# Altium schematic sheet Sinus_Inverter.SchDoc
size 1200 x 800 mm; SheetNumber: 1; SheetTotal: 1
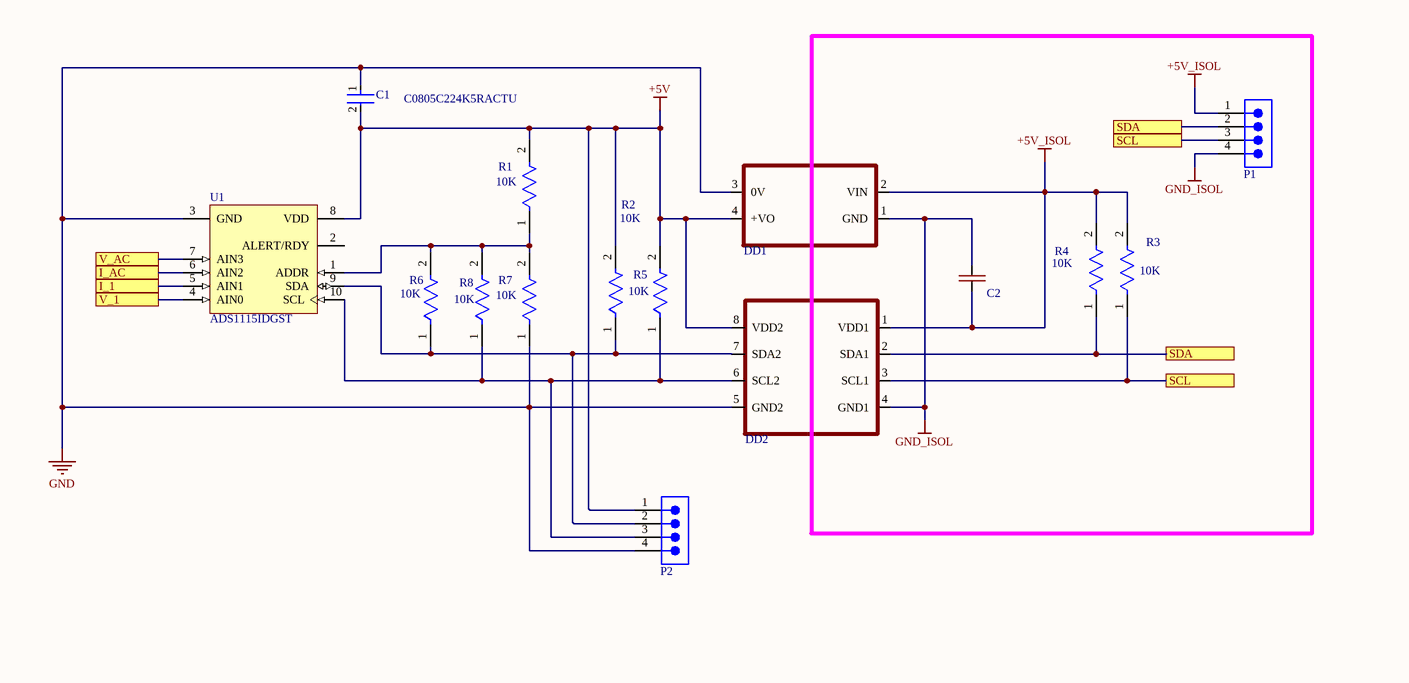
[diagram p0: Sinus_Inverter.SchDoc, top left]
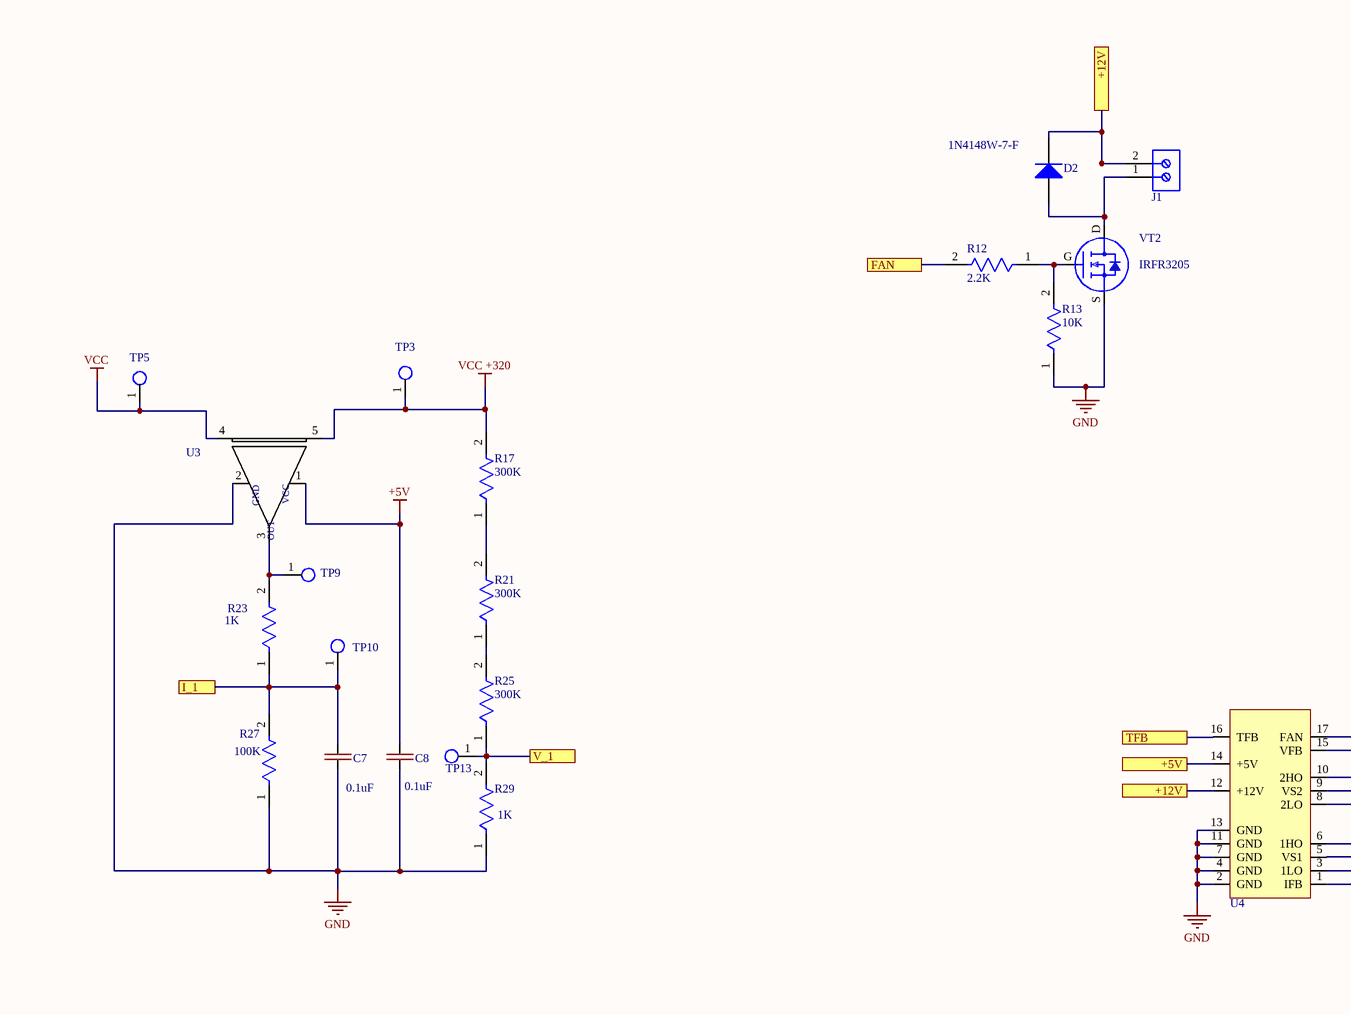
[diagram p1: Sinus_Inverter.SchDoc, top middle]
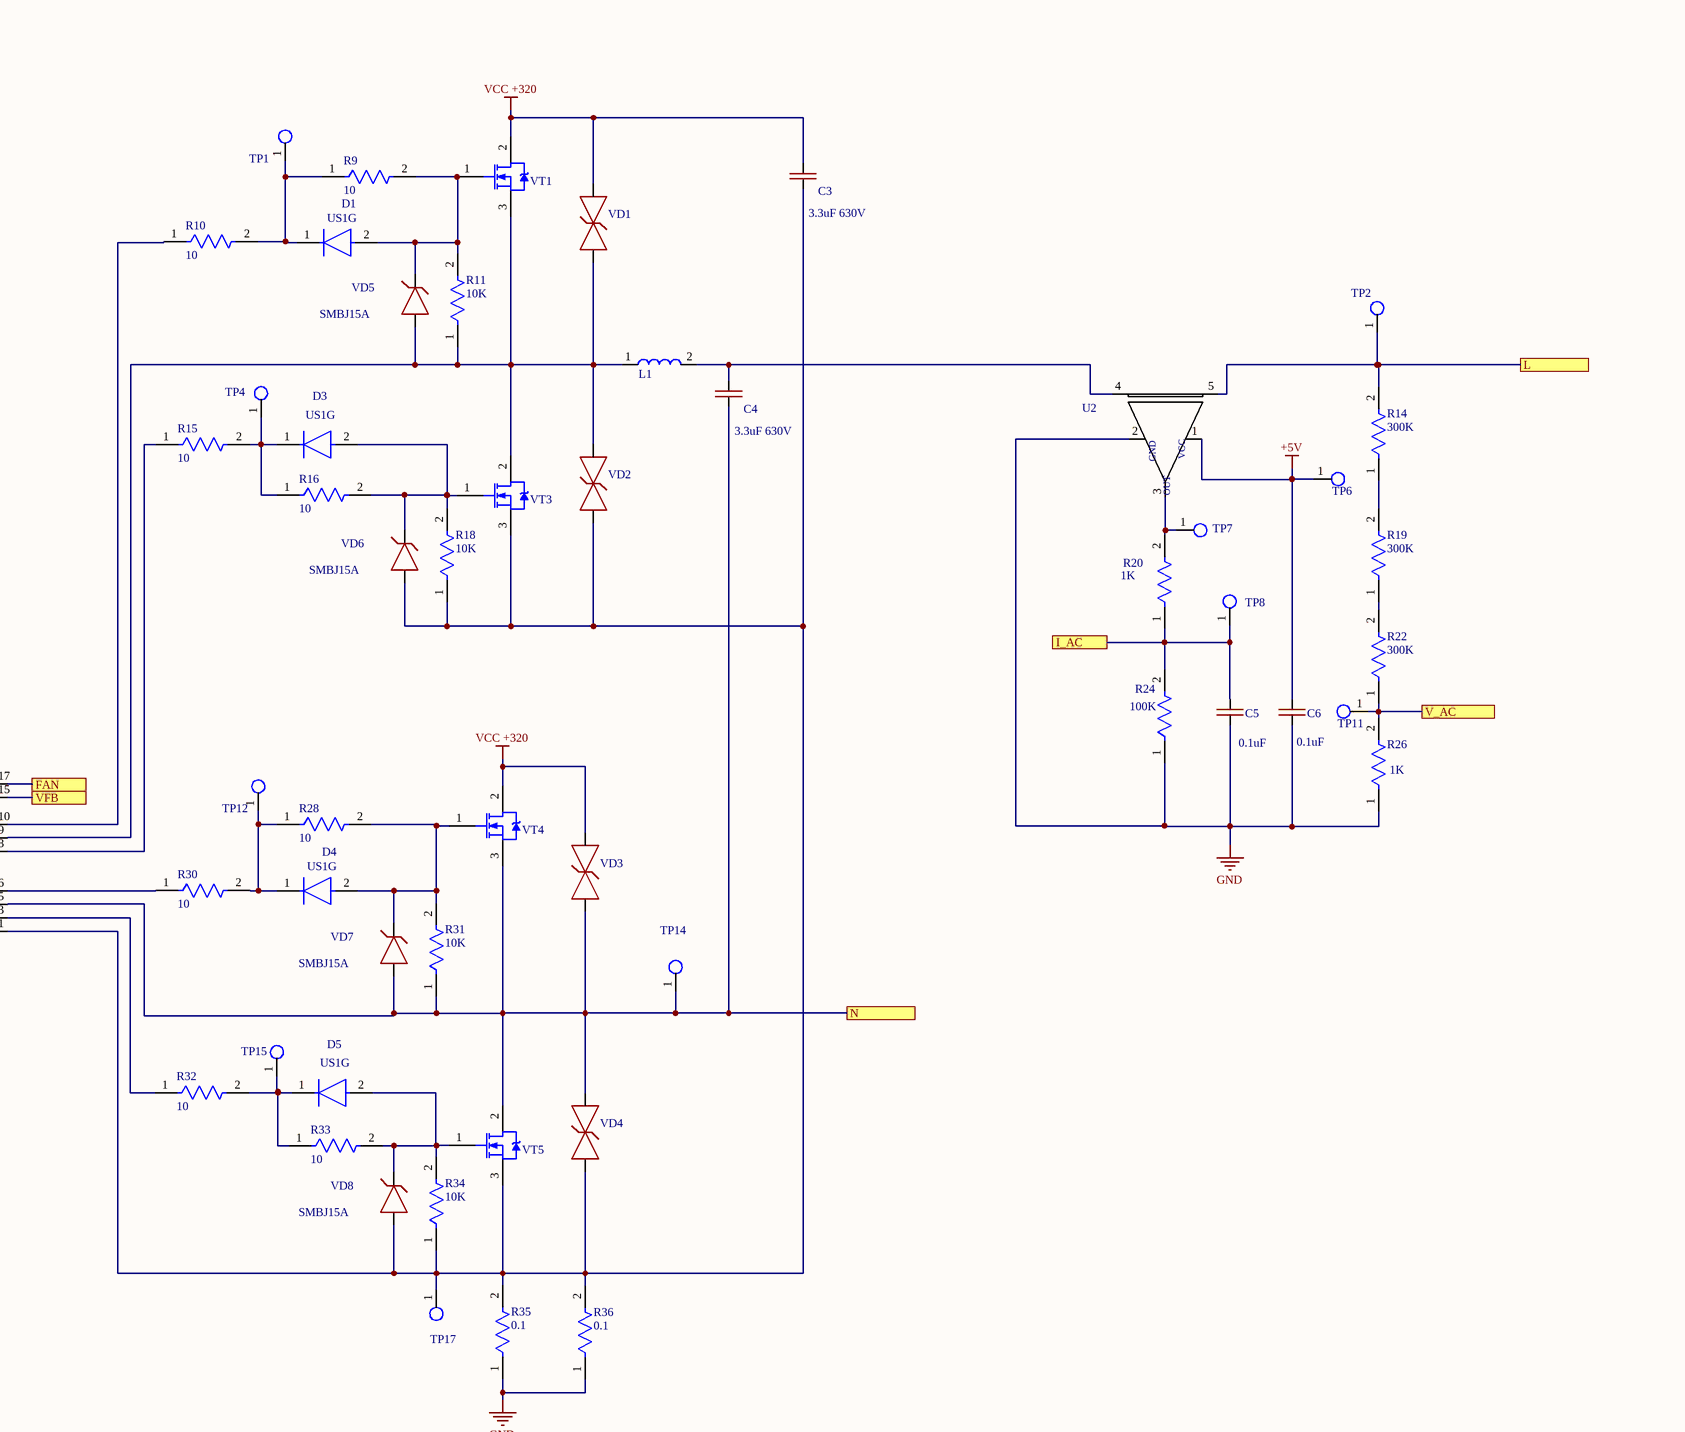
[diagram p2: Sinus_Inverter.SchDoc, top right]
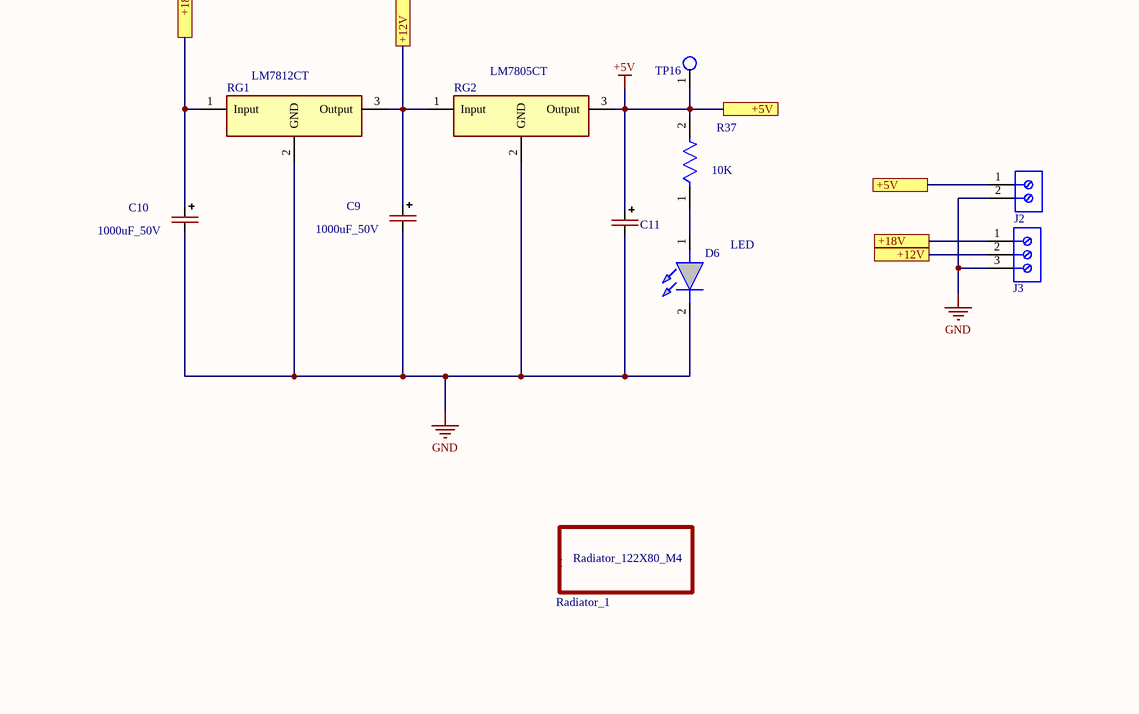
[diagram p3: Sinus_Inverter.SchDoc, bottom middle]
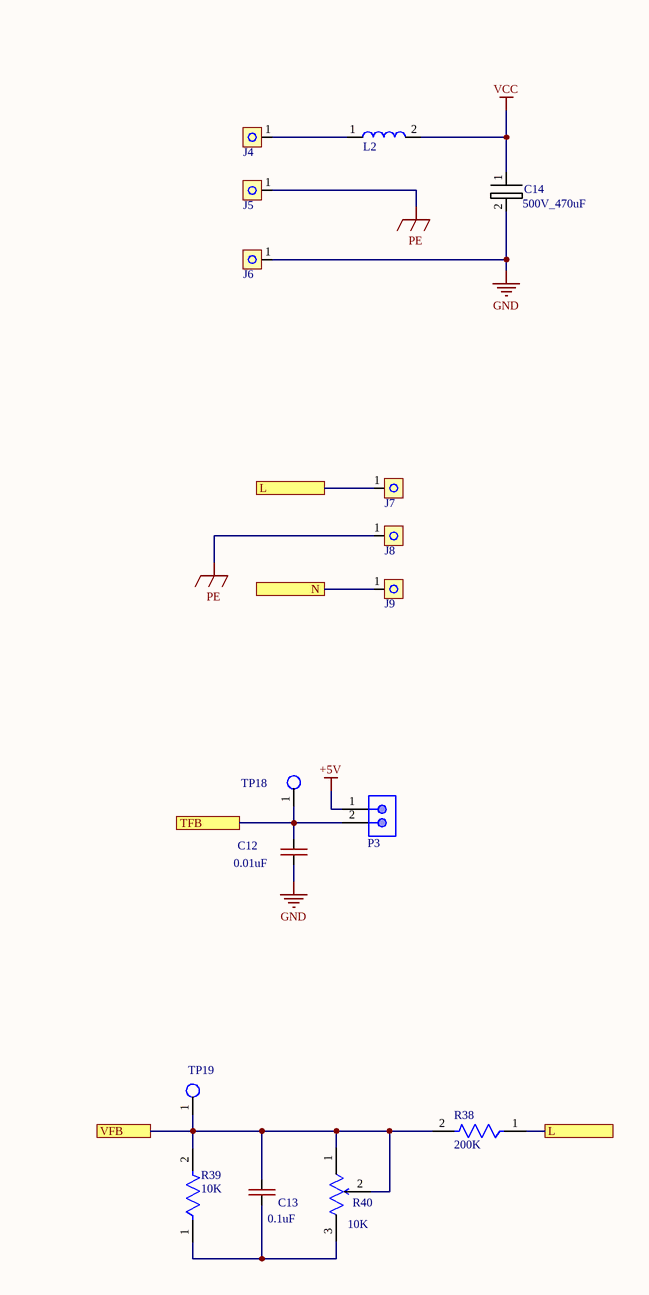
[diagram p4: Sinus_Inverter.SchDoc, bottom right]

## Parts
C1  C0805C224K5RACTU  [FP-C0805C-DN-MFG]
C2  CAP-NON-POLAR  [CAP-0805]  (value not drawn)
C3  3.3uF 630V  [CAP_4.7uF_630V]
C4  3.3uF 630V  [CAP_4.7uF_630V]
C5  0.1uF  [CAP-0805]
C6  0.1uF  [CAP-0805]
C7  0.1uF  [CAP-0805]
C8  0.1uF  [CAP-0805]
C9  1000uF_50V  [CAP_POL_13x26_1000uF_50V]
C10  1000uF_50V  [CAP_POL_13x26_1000uF_50V]
C11  CAP-POLAR  [CAPPOL-16x25]  (value not drawn)
C12  0.01uF  [CAP-0805]
C13  0.1uF  [CAP-0805]
C14  500V_470uF  [500V_470uF]
D1  US1G  [US1G_SMA]
D2  1N4148W-7-F  [DIOD-SOD123-2_V]
D3  US1G  [US1G_SMA]
D4  US1G  [US1G_SMA]
D5  US1G  [US1G_SMA]
D6  LED  [LED_BLUE]
DD1  B0505S-1W  [PLS-4-2.54mm]  (value not drawn)
DD2  ADUM1250ARZ  [SO8-150]  (value not drawn)
J1  691102710002  [691102710002]  (value not drawn)
J2  691101710002  [691101710002]  (value not drawn)
J3  691101710003  [691101710003]  (value not drawn)
J4  MG_136_HT  [Conn_MEIGAN_MG136HT]  (value not drawn)
J5  MG_136_HT  [Conn_MEIGAN_MG136HT]  (value not drawn)
J6  MG_136_HT  [Conn_MEIGAN_MG136HT]  (value not drawn)
J7  MG_136_HT  [Conn_MEIGAN_MG136HT]  (value not drawn)
J8  MG_136_HT  [Conn_MEIGAN_MG136HT]  (value not drawn)
J9  MG_136_HT  [Conn_MEIGAN_MG136HT]  (value not drawn)
L1  (no value)  [Coil_drosel]
L2  (no value)  [Coil_drosel]
P1  61900411121  [61900411121]  (value not drawn)
P2  61900411121  [61900411121]  (value not drawn)
P3  61900211121  [61900211121]  (value not drawn)
R1  10K  [RES-0805]
R2  10K  [RES-0805]
R3  10K  [RES-0805]
R4  10K  [RES-0805]
R5  10K  [RES-0805]
R6  10K  [RES-0805]
R7  10K  [RES-0805]
R8  10K  [RES-0805]
R9  10  [RES-1206]
R10  10  [RES-1206]
R11  10K  [RES-0805]
R12  2.2K  [RES-0805]
R13  10K  [RES-0805]
R14  300K  [RES-0805]
R15  10  [RES-1206]
R16  10  [RES-1206]
R17  300K  [RES-1206]
R18  10K  [RES-0805]
R19  300K  [RES-0805]
R20  1K  [RES-0805]
R21  300K  [RES-1206]
R22  300K  [RES-0805]
R23  1K  [RES-0805]
R24  100K  [RES-0805]
R25  300K  [RES-1206]
R26  1K  [FP-CRCW1210-e3-IPC_A]
R27  100K  [RES-0805]
R28  10  [RES-1206]
R29  1K  [FP-CRCW1210-e3-IPC_A]
R30  10  [RES-1206]
R31  10K  [RES-0805]
R32  10  [RES-1206]
R33  10  [RES-1206]
R34  10K  [RES-0805]
R35  0.1  [RES_5W_Ceramic_Yageo]
R36  0.1  [RES_5W_Ceramic_Yageo]
R37  10K  [RES-0805]
R38  200K  [RES-0805]
R39  10K  [RES-0805]
R40  10K  [RES_Adj_3296W_Bourns]
Radiator_1  Radiator_122X80_M4  [Radiator_122X80_M4]  (value not drawn)
RG1  (no value)  [TO-220_Bended_Rad]
RG2  (no value)  [TO-220_Bended_Rad]
TP1  Test_Point_PCB  [Test_Point]  (value not drawn)
TP2  (no value)  [Test_Point]
TP3  (no value)  [Test_Point]
TP4  (no value)  [Test_Point]
TP5  (no value)  [Test_Point]
TP6  (no value)  [Test_Point]
TP7  (no value)  [Test_Point]
TP8  (no value)  [Test_Point]
TP9  (no value)  [Test_Point]
TP10  (no value)  [Test_Point]
TP11  (no value)  [Test_Point]
TP12  (no value)  [Test_Point]
TP13  (no value)  [Test_Point]
TP14  (no value)  [Test_Point]
TP15  Test_Point_PCB  [Test_Point]  (value not drawn)
TP16  (no value)  [Test_Point]
TP17  (no value)  [Test_Point]
TP18  (no value)  [Test_Point]
TP19  (no value)  [Test_Point]
U1  ADS1115IDGST  [TI-DGS10_N]
U2  (no value)  [ACS758-100]
U3  (no value)  [ACS758-100]
U4  EGS002  [EGS002]  (value not drawn)
VD1  Suppressor  [P6KE350CA]  (value not drawn)
VD2  Suppressor  [P6KE350CA]  (value not drawn)
VD3  Suppressor  [P6KE350CA]  (value not drawn)
VD4  Suppressor  [P6KE350CA]  (value not drawn)
VD5  SMBJ15A  [DO-214AA]
VD6  SMBJ15A  [DO-214AA]
VD7  SMBJ15A  [DO-214AA]
VD8  SMBJ15A  [DO-214AA]
VT1  SPW47N60  [TO-247-3(Infineon)]  (value not drawn)
VT2  IRFR3205  [TO-220(bend2)]
VT3  SPW47N60  [TO-247-3(Infineon)]  (value not drawn)
VT4  SPW47N60  [TO-247-3(Infineon)]  (value not drawn)
VT5  SPW47N60  [TO-247-3(Infineon)]  (value not drawn)

## Ports
+5V, +12V, +18V, FAN, I_1, I_AC, L, N, SCL, SDA, TFB, V_1, V_AC, VFB

## Nets
+5V: C1.2 C6.2 C8.2 C11.1(+) DD1.4(+VO) DD2.8(VDD2) J2.1 P2.1 P3.1 R1.2 R2.2 R5.2 R37.2 RG2.3(Output) TP6.1(G9) TP16.1(G9) U1.8(VDD) U2.1(+VCC) U3.1(+VCC) U4.14(+5V) ; port +5V
+5V_ISOL: C2.1 DD1.2(VIN) DD2.1(VDD1) P1.1 R3.2 R4.2
GND: C1.1 C5.2 C6.1 C7.2 C8.1 C9.2(-) C10.2(-) C11.2(-) C12.1 C14.2 D6.2(K) DD1.3(0V) DD2.5(GND2) J2.2 J3.3 J6.1 P2.4 R7.1 R13.1 R24.1 R26.1 R27.1 R29.1 R35.1 R36.1 RG1.2(GND) RG2.2(GND) U1.3(GND) U2.2(GND) U3.2(GND) U4.2(GND) U4.4(GND) U4.7(GND) U4.11(GND) U4.13(GND) VT2.S
GND_ISOL: C2.2 DD1.1(GND) DD2.4(GND1) P1.4
PE: J5.1 J8.1
VCC: C14.1 L2.2 TP5.1(G9) U3.4(+IP)
VCC +320: C3.2 R17.2 TP3.1(G9) U3.5(-IP) VD1.2(A) VD3.2(A) VT1.2(DRAIN) VT4.2(DRAIN)
+12V: C9.1(+) D2.1(K) J1.2 J3.2 RG1.3(Output) RG2.1(Input) U4.12(+12V) ; port +12V
+18V: C10.1(+) J3.1 RG1.1(Input) ; port +18V
FAN: R12.2 U4.17(FAN) ; port FAN
I_1: C7.1 R23.1 R27.2 TP10.1(G9) U1.5(AIN1) ; port I_1
I_AC: C5.1 R20.1 R24.2 TP8.1(G9) U1.6(AIN2) ; port I_AC
L: J7.1 R14.2 R38.1 TP2.1(G9) U2.5(-IP) ; port L
N: C4.1 J9.1 R31.1 TP14.1(G9) U4.5(VS1) VD3.1(C) VD4.2(A) VD7.1(A) VT4.3(SOURCE) VT5.2(DRAIN) ; port N
SCL: DD2.3(SCL1) P1.3 R3.1 ; port SCL
SDA: DD2.2(SDA1) P1.2 R4.1 ; port SDA
TFB: C12.2 P3.2 TP18.1(G9) U4.16(TFB) ; port TFB
V_1: R25.1 R29.2 TP13.1(G9) U1.4(AIN0) ; port V_1
V_AC: R22.1 R26.2 TP11.1(G9) U1.7(AIN3) ; port V_AC
VFB: C13.1 R38.2 R39.2 R40.1(CCW) R40.2(WIPER) TP19.1(G9) U4.15(VFB) ; port VFB
NetC3_1: C3.1 R18.1 R34.1 R35.2 R36.2 TP17.1(G9) U4.1(IFB) VD2.1(C) VD4.1(C) VD6.1(A) VD8.1(A) VT3.3(SOURCE) VT5.3(SOURCE)
NetC4_2: C4.2 L1.2 U2.4(+IP)
NetC13_2: C13.2 R39.1 R40.3(CW)
NetD1_1: D1.1(C) R9.1 R10.2 TP1.1(G9)
NetD1_2: D1.2(A) R9.2 R11.2 VD5.2(C) VT1.1(GATE)
NetD2_2: D2.2(A) J1.1 VT2.D
NetD3_1: D3.1(C) R15.2 R16.1 TP4.1(G9)
NetD3_2: D3.2(A) R16.2 R18.2 VD6.2(C) VT3.1(GATE)
NetD4_1: D4.1(C) R28.1 R30.2 TP12.1(G9)
NetD4_2: D4.2(A) R28.2 R31.2 VD7.2(C) VT4.1(GATE)
NetD5_1: D5.1(C) R32.2 R33.1 TP15.1(G9)
NetD5_2: D5.2(A) R33.2 R34.2 VD8.2(C) VT5.1(GATE)
NetD6_1: D6.1(A) R37.1
NetDD2_6: DD2.6(SCL2) P2.3 R5.1 R8.1 U1.10(SCL)
NetDD2_7: DD2.7(SDA2) P2.2 R2.1 R6.1 U1.9(SDA)
NetJ4_1: J4.1 L2.1
NetL1_1: L1.1 R11.1 U4.9(VS2) VD1.1(C) VD2.2(A) VD5.1(A) VT1.3(SOURCE) VT3.2(DRAIN)
NetR1_1: R1.1 R6.2 R7.2 R8.2 U1.1(ADDR)
NetR10_1: R10.1 U4.10(2HO)
NetR12_1: R12.1 R13.2 VT2.G
NetR14_1: R14.1 R19.2
NetR15_1: R15.1 U4.8(2LO)
NetR17_1: R17.1 R21.2
NetR19_1: R19.1 R22.2
NetR20_2: R20.2 TP7.1(G9) U2.3(OUT)
NetR21_1: R21.1 R25.2
NetR23_2: R23.2 TP9.1(G9) U3.3(OUT)
NetR30_1: R30.1 U4.6(1HO)
NetR32_1: R32.1 U4.3(1LO)

Not connected (* = marked no-connect by the designer): U1 2(ALERT/RDY)

## Notes on the sheet
- (in symbol ACS758) VCC

## Library data of the parts
C1 = CMP-1036-04552-2: CAP CER 0.22UF 50V X7R 0805; Manufacturer: KEMET; Value: 0.22 μF; Temperature Coefficient: 30ppm/°C; Material: Ceramic; Tolerance: 0.1; ComponentLink2URL: https://content.kemet.com/datasheets/KEM_C1003_C0G_SMD.pdf; Temperature Characteristic: X7R; Device Class L3: Ceramic Capacitors; Lead Free: Yes; Temperature: -55°C to +125°C; RoHS: TRUE; Capacitance: 0.22 μF; Automotive: No; Octopart: https://octopart.com/c0805c224k5ractu-kemet-144670; Manufacturer Part Number: C0805C224K5RACTU; Temperature Range Low: -55°C; Height: 0.88mm; Device Class L1: Passive Components; Digikey Description: CAP CER 0.22UF 50V X7R 0805; ComponentLink2Description: Datasheet; Mouser Description: CAP CER 0.22UF 50V X7R 0805; Category: Cap; Ipc Land Pattern Name: CAPC200125X78; Temperature Range High: +125°C; Package: C0805C-DN; Device Class L2: Capacitors; Voltage Rating: 50 V
C3-C8 C12 C13 = CAP-NON-POLAR
C9 C10 = CAP_polar_Hitano
C14 = CAP_POL_LOW_IMP
D2 = 1N4148: Fast Switching Diode, 100 V, 0.15 A, -65 to 150 degC, 2-Pin?SOD123, RoHS, Tape and Reel; Recovery Time: 4ns; Brand: DiodesIncorporated; Unit Weight: 0.000353oz; Max Surge Current: 2A; Peak Reverse Voltage: 100V; Ir - Reverse Current: 1uA; Vf - Forward Voltage: 1.25V; Configuration: Single; If - Forward Current: 0.15A; Product Category: Diodes-GeneralPurpose,Power,Switching; Operating Temperature Range: -65Cto+150C; Packaging: Reel; Manufacturer URL: http://www.diodes.com/; Maximum Operating Temperature: +150C; Height: 1.25mm; Minimum Operating Temperature: -65C; Product: SwitchingDiodes; Package URL: http://www.diodes.com/datasheets/ds18004.pdf; Type: SwitchingDiode; Package Reference: SOD123-2; Width: 1.7mm; Datasheet URL: http://www.farnell.com/datasheets/1915529.pdf; Datasheet Version: Rev. 24-2, 10/2013; Series: 1N4148; Factory Pack Quantity: 3000; Length: 2.85mm; RoHS: True; Manufacturer: DiodesIncorporated; Mounting Style: SMD/SMT; Package / Case: SOD-123
D6 = LED: WURTH ELEKTRONIK - 151031YS06000 - LED, Yellow, Through Hole, T-1 (3mm), 30 mA, 2 V, 590 nm; Geometry.Height: 5.5mm; Manufacturer_Name: Wurth Elektronik; Manufacturer_Part_Number: 151031YS06000; Mouser Part Number: 710-151031YS06000; Mouser Price/Stock: https://www.mouser.co.uk/ProductDetail/Wurth-Elektronik/151031YS06000?qs=LlUlMxKIyB3xSYYW%252BcuBiQ%3D%3D; Arrow Part Number: *; Arrow Price/Stock: *; Mouser Testing Part Number: *; Mouser Testing Price/Stock: *; Datasheet Link: https://katalog.we-online.de/led/datasheet/151031YS06000.pdf
J1 = 691102710002: WR-TBL Series 102 Horizontal Entry Modular, THT, pitch 5mm, 2p; Manufacturer: Wurth Elektronik; Modularity: Yes; Rated Current: 15A; Working Voltage: 250V; ComponentLink1Description: Website Link; ComponentLink1URL: https://www.we-online.com/redexpert/article/691102710002?ad; ComponentLink2Description: Datasheet Link; ComponentLink2URL: https://www.we-online.com/redexpert/spec/691102710002?ad; Manufacturer Part Number: 691102710002; Category: Terminal Blocks; Match Code: WR-TBL; Mount: Through Hole; Operating Temperature Max: 105°C; Operating Temperature Min: -40°C; Packaging: Box; Application: Pressure Clamp; Number of Pins: 2; Number of Rows: 1; Orientation: Horizontal; Pitch: 5mm
J2 = 691101710002: WR-TBL Series 101 Horizontal Entry Modular, THT, pitch 5mm, 2p; Manufacturer: Wurth Elektronik; Modularity: Yes; Rated Current: 16A; Working Voltage: 250V; ComponentLink1Description: Website Link; ComponentLink1URL: https://www.we-online.com/redexpert/article/691101710002?ad; ComponentLink2Description: Datasheet Link; ComponentLink2URL: https://www.we-online.com/redexpert/spec/691101710002?ad; Manufacturer Part Number: 691101710002; Category: Terminal Blocks; Match Code: WR-TBL; Mount: Through Hole; Operating Temperature Max: 105°C; Operating Temperature Min: -40°C; Packaging: Box; Application: Pressure Clamp; Number of Pins: 2; Number of Rows: 1; Orientation: Horizontal; Pitch: 5mm
J3 = 691101710003: WR-TBL Series 101 Horizontal Entry Modular, THT, pitch 5mm, 3p; Manufacturer: Wurth Elektronik; Modularity: Yes; Rated Current: 16A; Working Voltage: 250V; ComponentLink1Description: Website Link; ComponentLink1URL: https://www.we-online.com/redexpert/article/691101710003?ad; ComponentLink2Description: Datasheet Link; ComponentLink2URL: https://www.we-online.com/redexpert/spec/691101710003?ad; Manufacturer Part Number: 691101710003; Category: Terminal Blocks; Match Code: WR-TBL; Mount: Through Hole; Operating Temperature Max: 105°C; Operating Temperature Min: -40°C; Packaging: Box; Application: Pressure Clamp; Number of Pins: 3; Number of Rows: 1; Orientation: Horizontal; Pitch: 5mm
J4-J9 = Connector_MEIGAN_MG136HT
L1 L2 = Coil
P1 P2 = 61900411121: WR-WTB THT Male Vertical Locking Header, pitch 2.54mm, 4pins; Manufacturer: Wurth Elektronik; Contact Resistance: 20mΩ; Rated Current: 3A; Working Voltage: 250VAC; Withstanding Voltage: 1000VAC; ComponentLink1Description: Website Link; ComponentLink1URL: https://www.we-online.com/redexpert/article/61900411121?ad; ComponentLink2Description: Datasheet Link; ComponentLink2URL: https://www.we-online.com/redexpert/spec/61900411121?ad; Manufacturer Part Number: 61900411121; Category: Wire-to-Board Connectors; Match Code: WR-WTB; Mount: Through Hole; Operating Temperature Max: 105°C; Operating Temperature Min: -40°C; Packaging: Bag; Length: 10.16mm; Width: 5.8mm; Height: 11.5mm; Gender: Male; Number of Pins: 4; Number of Rows: 1; Orientation: Vertical; Pitch: 2.54mm
P3 = 61900211121: WR-WTB THT Male Vertical Locking Header, pitch 2.54mm, 2p; Contact Resistance: 20mOhm; Rated Current: 3A; Working Voltage: 250VAC; Withstanding Voltage: 1000VAC; Pin Number: 2; ComponentLink1Description: Manufacturer; ComponentLink1URL: http://www.we-online.de; ComponentLink2Description: Datasheet; ComponentLink2URL: https://www.we-online.com/catalog/datasheet/61900211121.pdf; Packaging: Bag; Gender: Male; Pitch: 2.54mm; Published Date: January 2020; Publisher: Wurth Elektronik; Mounting Technology: THT; Operating Temperature: -40 to +105degC; Part Number: 61900211121; Type: Vertical
R1-R25 R27 R28 R30-R39 = RES-CONST
R26 R29 = CMP-2005-01987-2: RES SMD 1K OHM 1% 1/2W 1992; Resistance: 0mR; Temperature Coefficient: 0ppm/°C; Max Power Dissipation: 500mW; Voltage Rating: 200V; Packaging: Tape and Reel; Max Operating Temperature: 155°C; REACH SVHC: No SVHC; Min Operating Temperature: -55°C; Package Quantity: 1; Length: 3.2mm; Case Code (Metric): 3225; Case/Package: 1210; Composition: Thick Film; Military Standard: Not; Contact Plating: Tin; Case Code (Imperial): 1210; Radiation Hardening: No; Depth: 2.5mm; Termination: SMD/SMT; Features: Automotive AEC-Q200; Width: 0.098inch; Mount: Surface Mount; Power Rating: 500mW; Weight: 0.000564oz; Number of Terminations: 2; Height: 0.55mm
R40 = RES_Adj
RG1 = LM7812CT: REG IC REG LINEAR 12V 1A TO220AB; Manufacturer: Fairchild; Voltage Dropout (Max): 2V @ 1A (Typ); Voltage - Input (Max): 35V; Voltage - Output: 5V; helpURL: https://upverter.com/upn/revision/b27a7358b7dd93a3/; ComponentLink2Description: Datasheet; Temperature: -40°C to +125°C; Package: TO220; Supplier 2: Mouser; Price: 0.384521982769; Supplier 1: Digi-Key; ComponentLink1URL: https://upverter.com/upn/revision/b27a7358b7dd93a3/; Supplier Part Number 2: 512-LM7805CT; Supplier Part Number 1: LM7805CT-ND; ComponentLink1Description: Upverter; ComponentLink2URL: https://www.fairchildsemi.com/datasheets/LM/LM7805.pdf; RoHS: TRUE; Mouser Part Number: 512-LM7805CT; Ipc Land Pattern Name: TO-220; Temperature Range High: +125°C; Digikey Description: REG IC REG LINEAR 5V 1A TO220AB; Digikey Part Number: LM7805CT-ND; Lead Free: yes; Temperature Range Low: -40°C; Current-Output: 1A; Part Number: LM7812CT
RG2 = LM7805CT: REG IC REG LINEAR 5V 1A TO220AB; Manufacturer: Fairchild; Voltage Dropout (Max): 2V @ 1A (Typ); Voltage - Input (Max): 35V; helpURL: https://upverter.com/upn/revision/b27a7358b7dd93a3/; ComponentLink2Description: Datasheet; Temperature: -40°C to +125°C; Package: TO220; Supplier 2: Mouser; Price: 0.384521982769; Supplier 1: Digi-Key; ComponentLink1URL: https://upverter.com/upn/revision/b27a7358b7dd93a3/; Supplier Part Number 2: 512-LM7805CT; Supplier Part Number 1: LM7805CT-ND; ComponentLink1Description: Upverter; ComponentLink2URL: https://www.fairchildsemi.com/datasheets/LM/LM7805.pdf; RoHS: TRUE; Mouser Part Number: 512-LM7805CT; Ipc Land Pattern Name: TO-220; Temperature Range High: +125°C; Digikey Description: REG IC REG LINEAR 5V 1A TO220AB; Digikey Part Number: LM7805CT-ND; Lead Free: yes; Temperature Range Low: -40°C; Voltage - Output: 5V; Current-Output: 1A; Part Number: LM7805CT
TP1-TP19 = TP_PCB?: Test_Point
U1 = CMP-0003-00378-2: 16-Bit ADC with Integrated Multiplexer, PGA, Comparator, Oscillator, and Reference, -40 to 125 degC, 10-pin SOP (DGS10), Green (RoHS & no Sb/Br); Manufacturer: Texas Instruments; Sample Rate (max)(SPS): 860; SubFamily: Precision ADC (<=10MSPS); Architecture: Delta-Sigma; Digital Supply(Min)(V): 2; Resolution(Bits): 16; Digital Supply(Max)(V): 5.5; INL(Max)(+/-LSB): 1; Interface: Serial I2C; # Input Channels: 4; Eco-Plan: Green (RoHS & no Sb/Br); PackageDescription: 10-Pin Plastic Small Outline, Body 3 x 3 mm, Pitch 0.5 mm; Mounting Technology: Surface Mount; PackageReference: DGS10; DatasheetVersion: SBAS444B; ComponentLink3Description: Package Specification; ComponentLink1Description: Manufacturer URL; PartNumber: ADS1115IDGST; ComponentLink3URL: http://www.ti.com/lit/ml/mpds035b/mpds035b.pdf; ComponentLink2URL: http://www.ti.com/general/docs/lit/getliterature.tsp?genericPartNumber=ADS1115&fileType=pdf; Analog Voltage AV/DD(Min)(V): 2; ComponentLink2Description: Datasheet; PackageVersion: 4073272/C, 02/2004; Analog Voltage AV/DD(Max)(V): 5.5; Code_JEDEC: MO-153; ComponentLink1URL: http://www.ti.com/
U2 U3 = ACS758
U4 = EGS002: EGS002  PWM